# Altium schematic sheet PA.SchDoc
size A4
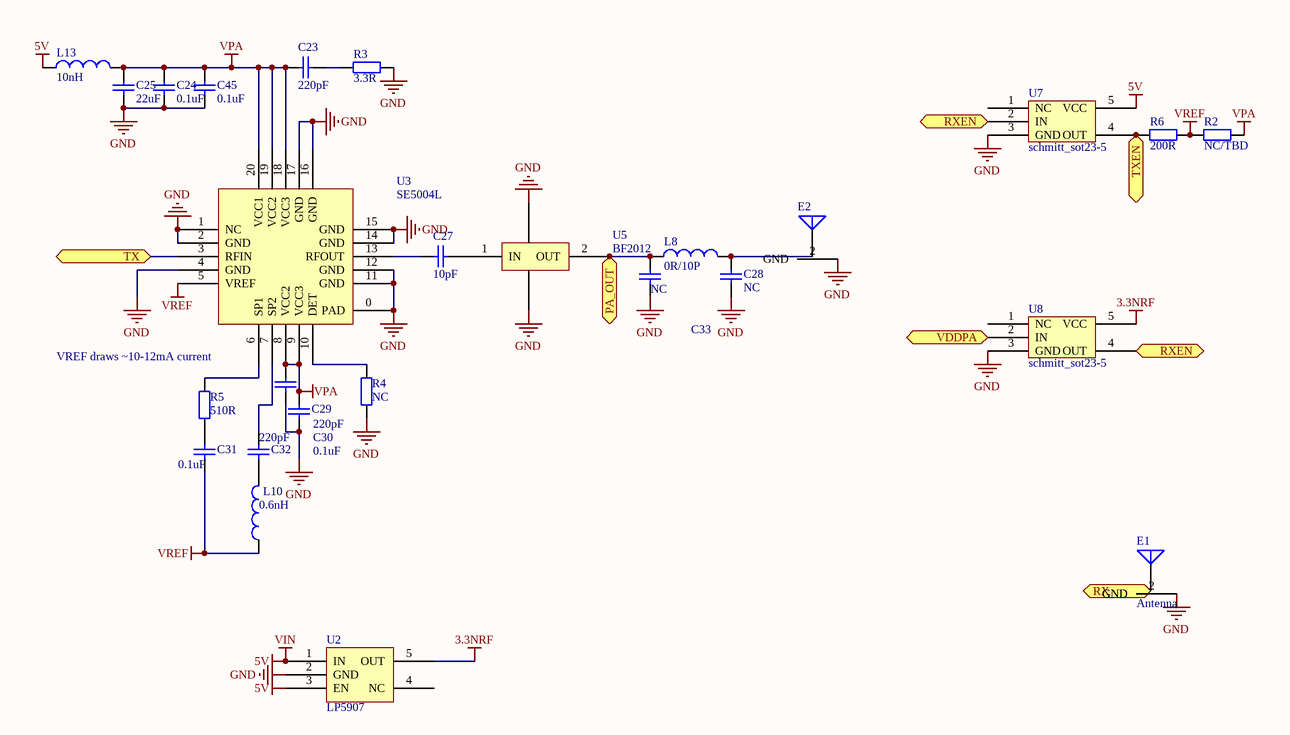
[diagram p0: PA.SchDoc]

## Parts
C23  value 220pF  [0402]  (hidden comment: Cap)
C24  value 0.1uF  [0402]  (hidden comment: Cap)
C25  value 22uF  [0805]  (hidden comment: Cap)
C27  value 10pF  [0402]  (hidden comment: Cap)
C28  value NC  [0402]  (hidden comment: Cap)
C29  value 0.1uF  [0402]  (hidden comment: Cap)
C30  value 220pF  [0402]  (hidden comment: Cap)
C31  value 0.1uF  [0402]  (hidden comment: Cap)
C32  value 220pF  [0402]  (hidden comment: Cap)
C33  value NC  [0402]  (hidden comment: Cap)
C45  value 0.1uF  [0402]  (hidden comment: Cap)
E1  Antenna  [IPEX]
E2  Antenna  [IPEX]  (value not drawn)
L8  value 0R/10P  [0402]  (hidden comment: Inductor)
L10  value 0.6nH  [0402]  (hidden comment: Inductor)
L13  value 10nH  [0402]  (hidden comment: Inductor)
R2  value NC/TBD  [0402]  (hidden comment: Res2)
R3  value 3.3R  [0402]  (hidden comment: Res2)
R4  value NC  [0402]  (hidden comment: Res2)
R5  value 510R  [0402]  (hidden comment: Res2)
R6  value 200R  [0402]  (hidden comment: Res2)
U2  LP5907  [SOT23-5]
U3  SE5004L  [SE5004L]
U5  BF2012  [LFB2H5]
U7  schmitt_sot23-5  [SOT23-5]
U8  schmitt_sot23-5  [SOT23-5]

## Ports
PA_OUT, RX, RXEN, TX, TXEN, VDDPA

## Nets
3.3NRF: U2.5(OUT) U8.5(VCC)
5V: L13.1 U2.1(IN) U2.3(EN) U7.5(VCC)  [also labelled VIN]
GND: C24.2 C25.1 C28.2 C29.1 C30.1 C33.2 C45.2 E1.2(GND) E2.2(GND) R3.1 R4.1 U2.2(GND) U3.0(PAD) U3.1(NC) U3.2(GND) U3.4(GND) U3.11(GND) U3.12(GND) U3.14(GND) U3.15(GND) U3.16(GND) U3.17(GND) U5.0(GND) U7.3(GND) U8.3(GND)
VPA: C23.2 C24.1 C25.2 C29.2 C30.2 C45.1 L13.2 R2.1 U3.8(VCC2) U3.9(VCC3) U3.18(VCC3) U3.19(VCC2) U3.20(VCC1)
VREF: C31.1 L10.1 R2.2 R6.1 U3.5(VREF)
PA_OUT: C33.1 L8.1 U5.2(OUT) ; port PA_OUT
RX: E1.1(ANT) ; port RX
RXEN: U7.2(IN) U8.4(OUT) ; port RXEN
TX: U3.3(RFIN) ; port TX
TXEN: R6.2 U7.4(OUT) ; port TXEN
VDDPA: U8.2(IN) ; port VDDPA
NetC23_1: C23.1 R3.2
NetC27_1: C27.1 U3.13(RFOUT)
NetC27_2: C27.2 U5.1(IN)
NetC28_1: C28.1 E2.1(ANT) L8.2
NetC31_2: C31.2 R5.1
NetC32_1: C32.1 L10.2
NetC32_2: C32.2 U3.7(SP2)
NetR4_2: R4.2 U3.10(DET)
NetR5_2: R5.2 U3.6(SP1)

Not connected (* = marked no-connect by the designer): U2 4(NC); U7 1(NC); U8 1(NC)

## Notes on the sheet
- VREF draws ~10-12mA current

## Library data of the parts
C23-C25 C27-C33 C45 = Cap: Capacitor; Published: 8-Jun-2000; LatestRevisionDate: 17-Jul-2002; LatestRevisionNote: Re-released for DXP Platform.; PackageReference: RAD-0.3; Publisher: Altium Limited; PackageDescription: Radial Cap, Thru-Hole; 2 Leads; 0.3 in Pin Spacing
E1 E2 = Antenna: Generic Antenna; Published: 24-Mar-1999; LatestRevisionDate: 17-Jul-2002; LatestRevisionNote: Re-released for DXP Platform.; PackageReference: PIN1; Publisher: Altium Limited
L8 L10 L13 = Inductor: Code_IEC: 1005; Published: 8-Jun-2000; LatestRevisionDate: 29-May-2009; LatestRevisionNote: IPC-7351 Footprint Added.; PackageReference: 0402-A; Publisher: Altium Limited; PackageDescription: Chip Inductor; Code_JEITA: 0402
R2-R6 = Res2: Resistor; Published: 8-Jun-2000; LatestRevisionDate: 17-Jul-2002; LatestRevisionNote: Re-released for DXP Platform.; PackageReference: AXIAL-0.4; Publisher: Altium Limited; PackageDescription: Axial Device, Thru-Hole; 2 Leads; 0.4 in Pin Spacing